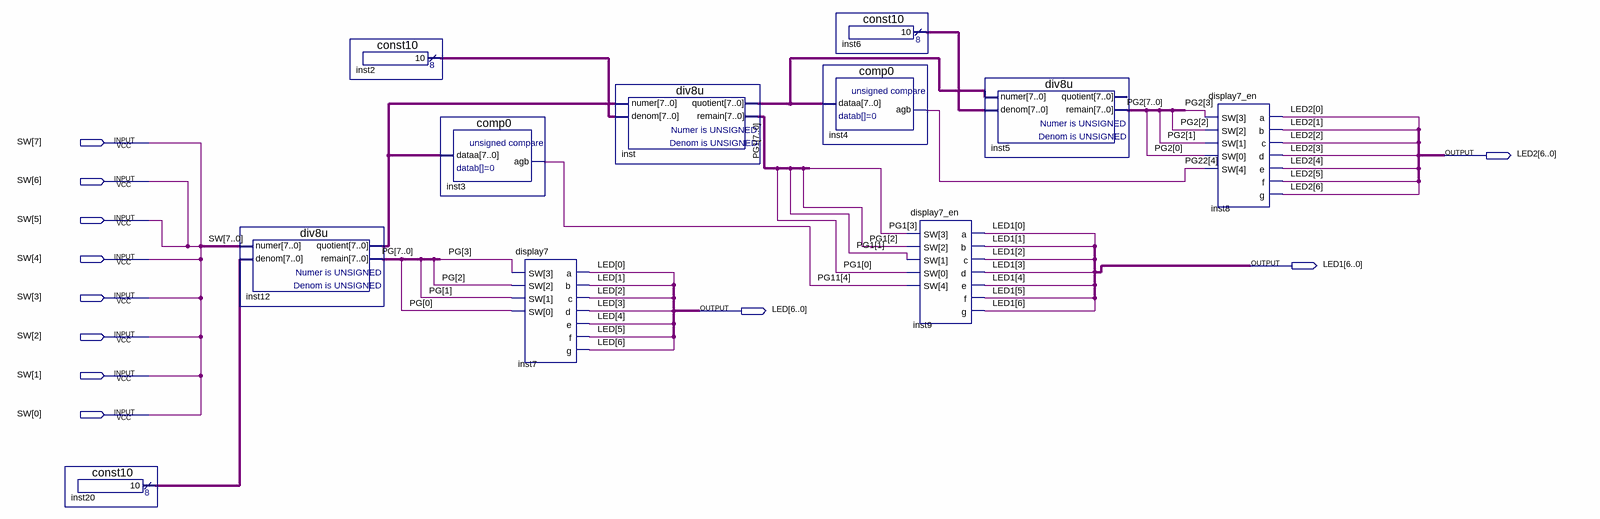
[diagram p0: schematic sheet]
// Quartus schematic display_8bits.bdf as structural Verilog: 11 symbols, 11 pins
module display_8bits (
  input  [7:0] SW,
  output [6:0] LED2,
  output [6:0] LED1,
  output [6:0] LED
);

  wire [4:4] PG11, PG22;
  wire [7:0] inst2_result, inst6_result, inst12_quotient, inst20_result, inst_quotient, PG, PG1, PG2;

  const10 inst20 (.result(inst20_result));
  div8u inst12 (.numer({SW[7:6], SW[6], {5{SW[4]}}}), .denom(inst20_result), .quotient(inst12_quotient), .remain(PG));
  const10 inst2 (.result(inst2_result));
  comp0 inst3 (.dataa(inst12_quotient), .agb(PG11[4]));
  display7 inst7 (.SW(PG[3:0]), .a(LED[0]), .b(LED[1]), .c(LED[2]), .d(LED[3]), .e(LED[4]), .f(LED[5]), .g(LED[6]));
  div8u inst (.numer(inst12_quotient), .denom(inst2_result), .quotient(inst_quotient), .remain(PG1));
  const10 inst6 (.result(inst6_result));
  comp0 inst4 (.dataa(inst_quotient), .agb(PG22[4]));
  display7_en inst9 (
    .SW({PG11[4], PG1[3:0]}), .a(LED1[0]), .b(LED1[1]), .c(LED1[2]), .d(LED1[3]), .e(LED1[4]), .f(LED1[5]),
    .g(LED1[6]));
  div8u inst5 (.numer(inst_quotient), .denom(inst6_result), .remain(PG2));  // open: quotient
  display7_en inst8 (
    .SW({PG22[4], PG2[3:0]}), .a(LED2[0]), .b(LED2[1]), .c(LED2[2]), .d(LED2[3]), .e(LED2[4]), .f(LED2[5]),
    .g(LED2[6]));

  assign {SW[5], SW[3:0]} = {SW[6], {4{SW[4]}}};
endmodule
